# EAGLE schematic AMC_GERBER_F (EAGLE 5.07)

## Sheet 1 of 2
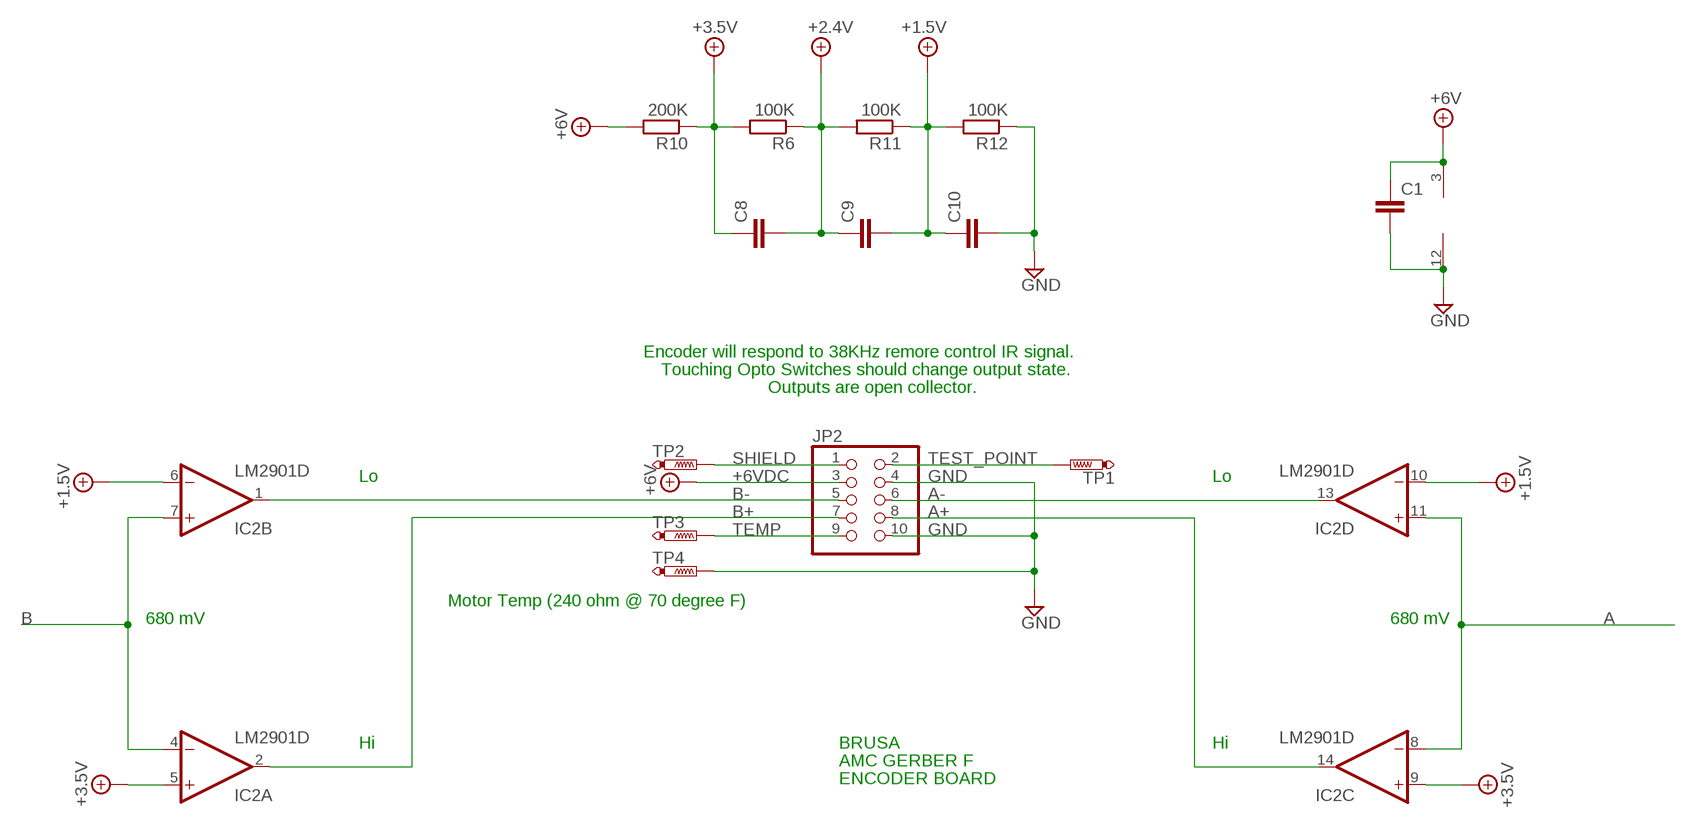
[diagram p0: schematic, sheet 1]

### Parts
C1  C-EUC1005  [C1005]
C8  C-EUC0603  [C0603]
C9  C-EUC0603  [C0603]
C10  C-EUC0603  [C0603]
IC2  LM2901D  [SO14]
JP2  PINHD-2X5  [2X05]
R6  100K  R-EU_R0603  [R0603]
R10  200K  R-EU_R0603  [R0603]
R11  100K  R-EU_R0603  [R0603]
R12  100K  R-EU_R0603  [R0603]
TP1  PTR1PAD1-17  [P1-17]
TP2  PTR1PAD1-17  [P1-17]
TP3  PTR1PAD1-17  [P1-17]
TP4  PTR1PAD1-17  [P1-17]

### Nets
+1.2V: C9.2 C10.1 IC2.6(B:-IN) IC2.10(D:-IN) R11.1 R12.2 ; supply symbol labelled +1.5V
+2.4V: C8.2 C9.1 R6.1 R11.2 ; also sheet 2
+3.5V: C8.1 IC2.5(A:+IN) IC2.9(C:+IN) R6.2 R10.1
+6VDC: JP2.3 ; supply symbol labelled +6V
+7V: C1.1 IC2.3(P:V+) R10.2 ; supply symbol labelled +6V ; also sheet 2
A: IC2.8(C:-IN) IC2.11(D:+IN) ; also sheet 2
A+: IC2.14(C:OUT) JP2.8
A-: IC2.13(D:OUT) JP2.6
B: IC2.4(A:-IN) IC2.7(B:+IN) ; also sheet 2
B+: IC2.2(A:OUT) JP2.7
B-: IC2.1(B:OUT) JP2.5
GND: C1.2 C10.2 IC2.12(P:V-) JP2.4 JP2.10 R12.1 TP4.TP ; also sheet 2
SHIELD: JP2.1 TP2.TP
TEMP: JP2.9 TP3.TP
TEST_POINT: JP2.2 TP1.TP

### Notes on the sheet
- Encoder will respond to 38KHz remore control IR signal.
- Touching Opto Switches should change output state.
- Outputs are open collector.
- Lo | Lo
- Motor Temp (240 ohm @ 70 degree F)
- 680 mV | 680 mV
- Hi | BRUSA | Hi
- AMC GERBER F
- ENCODER BOARD

## Sheet 2 of 2
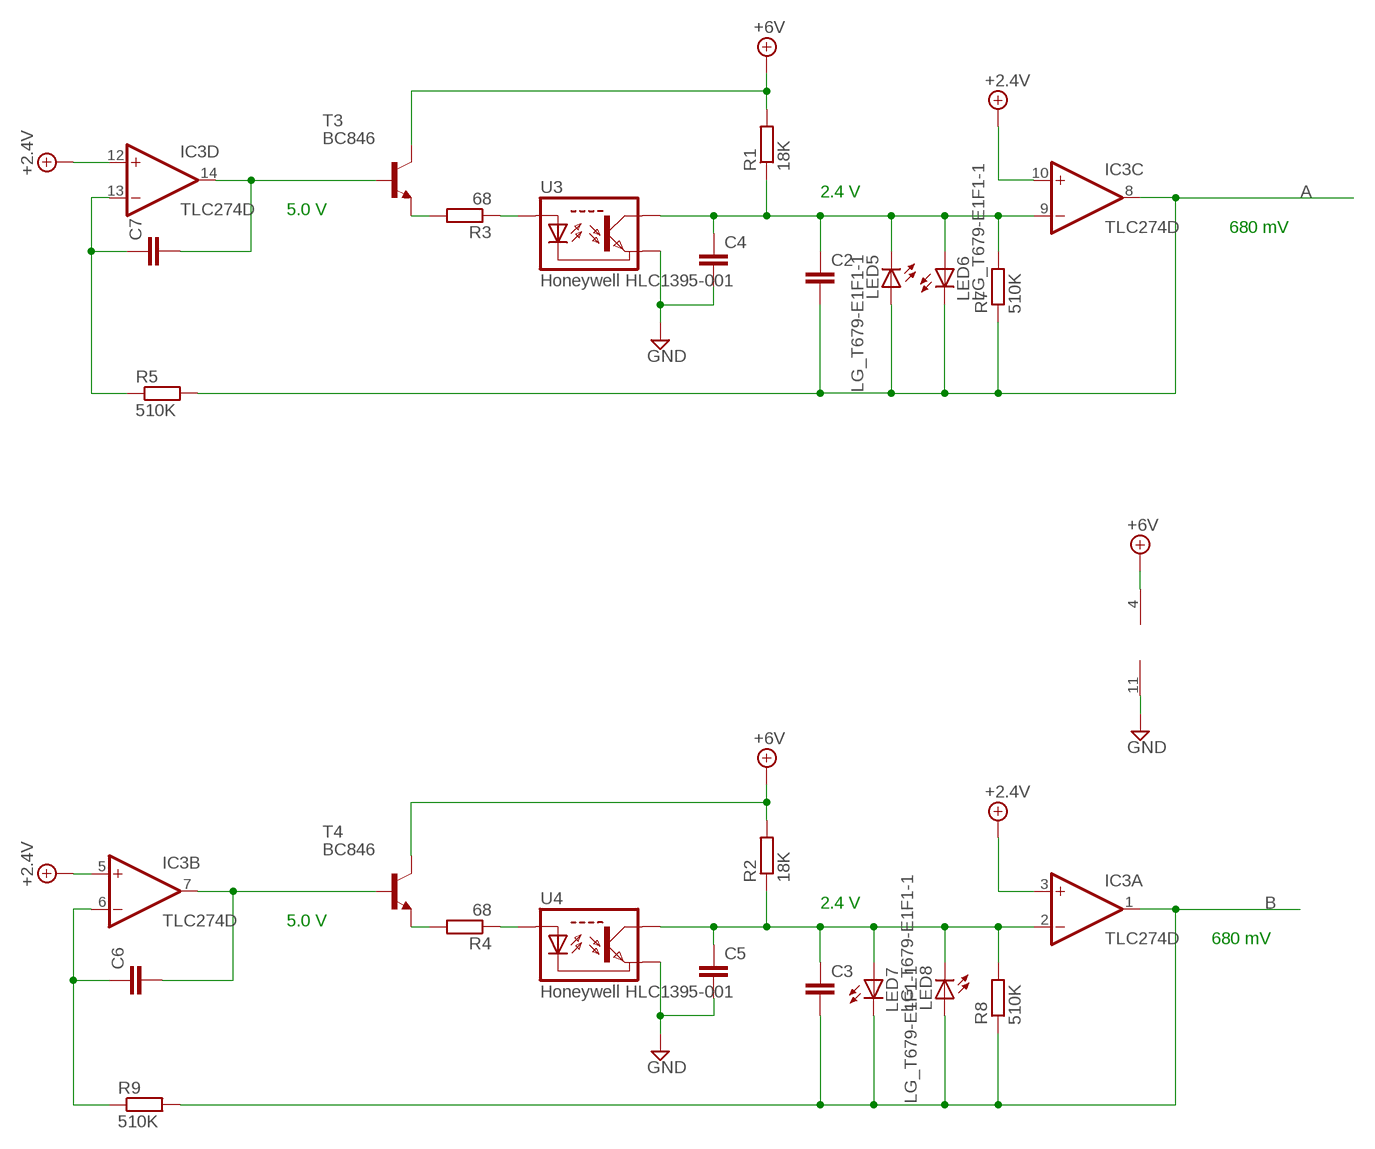
[diagram p1: schematic, sheet 2]

### Parts
C2  C-EUC0603  [C0603]
C3  C-EUC0603  [C0603]
C4  C-EUC0603  [C0603]
C5  C-EUC0603  [C0603]
C6  C-EUC0805  [C0805]
C7  C-EUC0805  [C0805]
IC3  TLC274D  [SO14]
LED5  LG_T679-E1F1-1  [PLCC2]
LED6  LG_T679-E1F1-1  [PLCC2]
LED7  LG_T679-E1F1-1  [PLCC2]
LED8  LG_T679-E1F1-1  [PLCC2]
R1  18K  R-EU_R0603  [R0603]
R2  18K  R-EU_R0603  [R0603]
R3  68  R-EU_R0603  [R0603]
R4  68  R-EU_R0603  [R0603]
R5  510K  R-EU_R0603  [R0603]
R7  510K  R-EU_R0603  [R0603]
R8  510K  R-EU_R0603  [R0603]
R9  510K  R-EU_R0603  [R0603]
T3  BC846  [SOT23]
T4  BC846  [SOT23]
U3  Honeywell HLC1395-001  HLC1395  [HCL1395]
U4  Honeywell HLC1395-001  HLC1395  [HCL1395]

### Nets
+2.4V: IC3.5(B:+IN) IC3.10(C:+IN) ; also sheet 1
+7V: IC3.4(P:V+) T3.3(C) T4.3(C) ; supply symbol labelled +6V ; also sheet 1
A: C2.2 IC3.8(C:OUT) LED5.A LED6.C R5.2 R7.1 ; also sheet 1
B: C3.2 IC3.1(A:OUT) LED7.C LED8.A R8.1 R9.2 ; also sheet 1
GND: C4.2 C5.2 IC3.11(P:V-) U3.P$2(COMMON) U4.P$2(COMMON) ; also sheet 1
N$2: C2.1 C4.1 IC3.9(C:-IN) LED5.C LED6.A R1.1 R7.2 U3.P$3(COLLECTOR)
N$5: C3.1 C5.1 IC3.2(A:-IN) LED7.A LED8.C R2.1 R8.2 U4.P$3(COLLECTOR)
N$6: R3.2 T3.2(E)
N$7: R3.1 U3.P$1(ANODE)
N$8: R4.2 T4.2(E)
N$9: R4.1 U4.P$1(ANODE)
N$10: C6.2 IC3.7(B:OUT) T4.1(B)
N$13: C7.2 IC3.14(D:OUT) T3.1(B)
N$14: C6.1 IC3.6(B:-IN) R9.1
N$16: C7.1 IC3.13(D:-IN) R5.1
Unconnected: IC3.3(A:+IN) IC3.12(D:+IN) R1.2 R2.2

### Notes on the sheet
- 2.4 V
- 5.0 V
- 680 mV
- 2.4 V
- 5.0 V
- 680 mV

## Library data of the parts
C1-C10 = rcl:C-EU: CAPACITOR, European symbol
IC2 = linear:LM2901: COMPARATOR
IC3 = linear:TLC274: OP AMP
JP2 = pinhead:PINHD-2X5: PIN HEADER
LED5-LED8 = led:*_T679-?-1: LC TOPLED® Low Current LED Source: http://catalog.osram-os.com .. LG_LS_LY_T679_OBS.pdf; COLOR: green
R1-R12 = rcl:R-EU_: RESISTOR, European symbol
T3 T4 = transistor:BC846: NPN TRANSISTOR
TP1-TP4 = testpad:PTR1: TEST PIN
U3 U4 = opto-honeywell-3000:HLC1395: Honeywell HLC1395-001 Reflective Optoswitch